# EAGLE design Sensors (EAGLE 8.1.1)
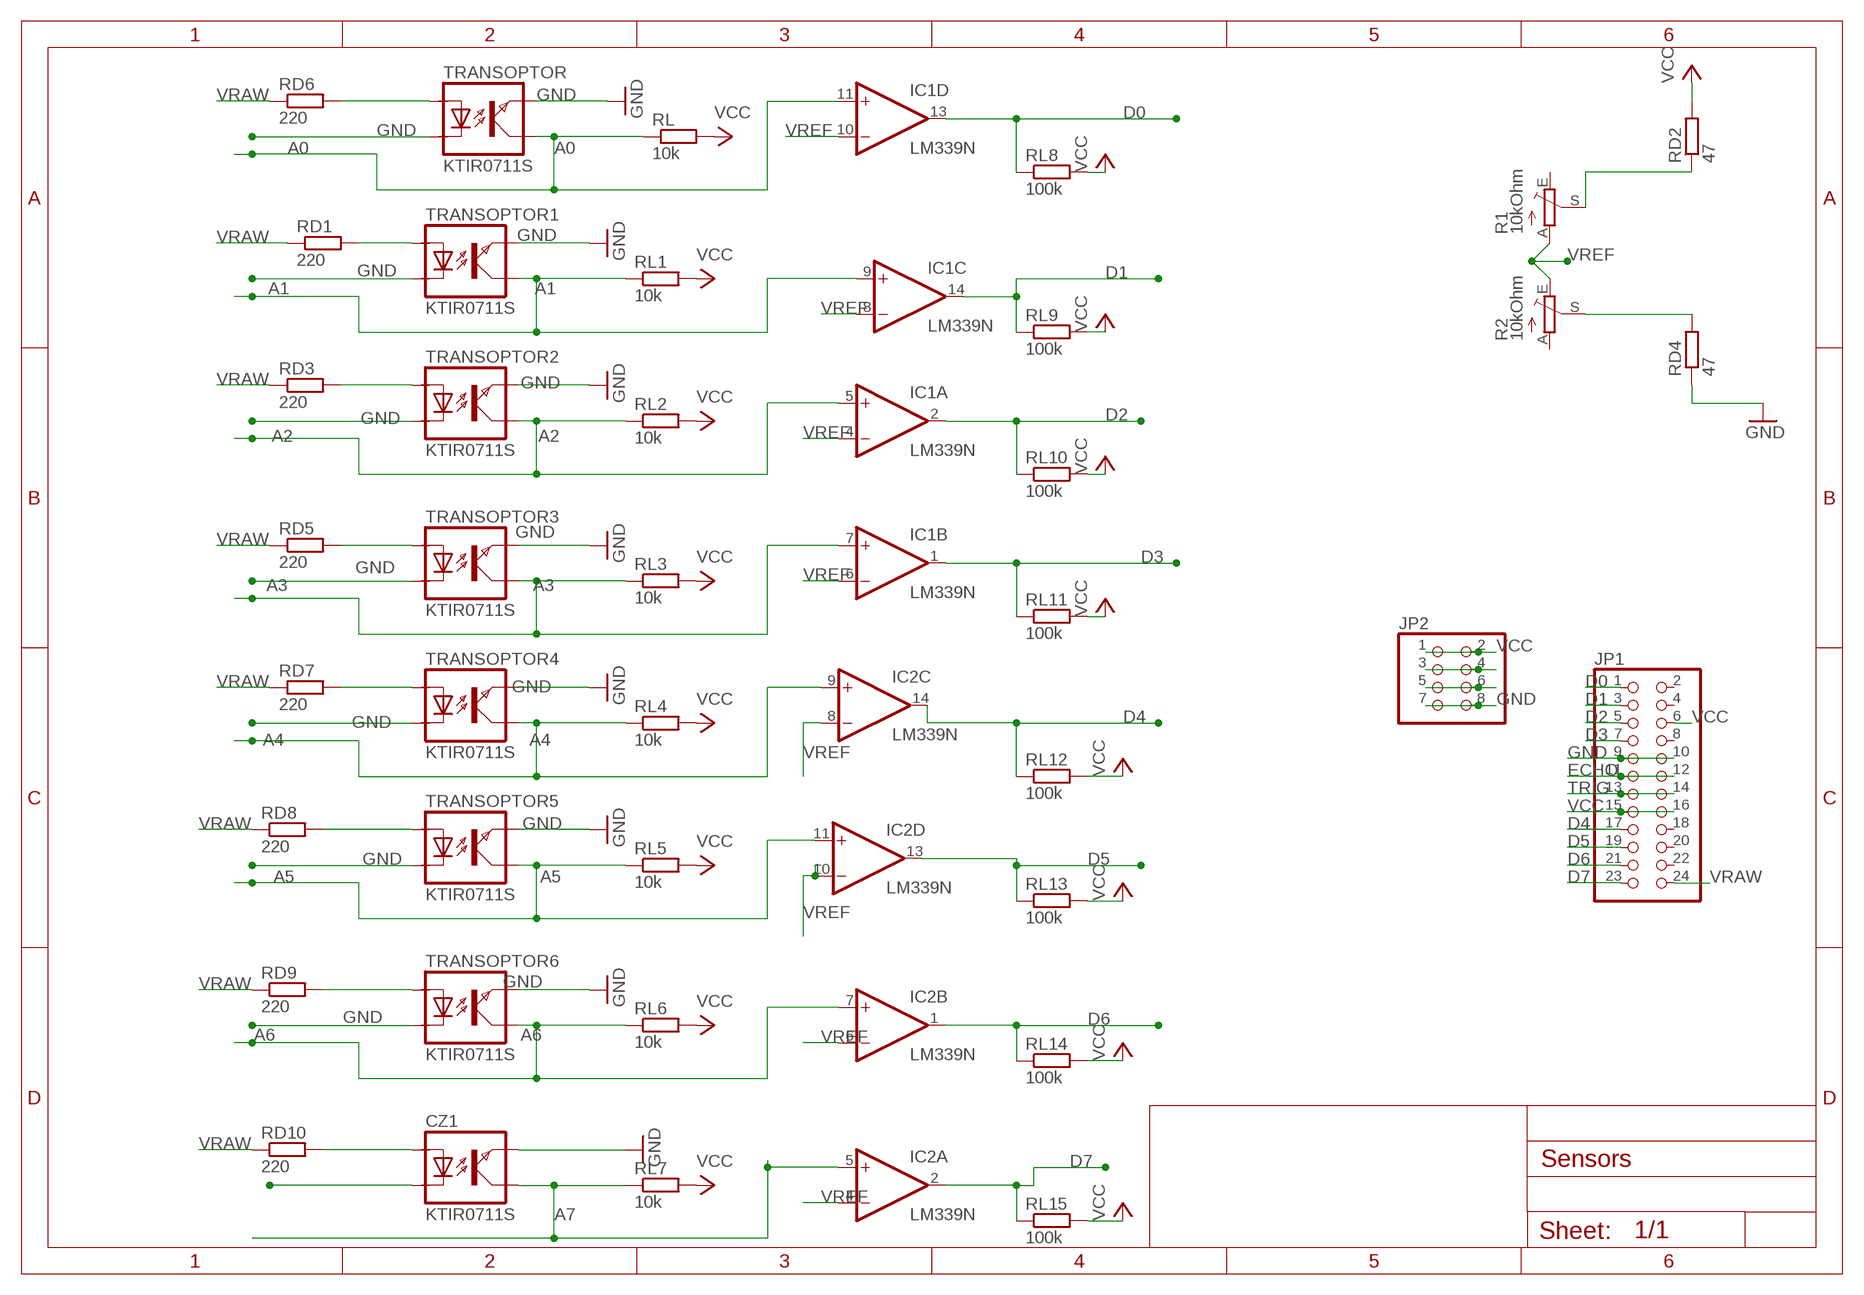
[diagram p0: schematic, sheet 1]

## Parts
CZ1  KTIR0711S  [TOP]
IC1  LM339N  [DIL14]
IC2  LM339N  [DIL14]
JP1  PINHD-2X12  [2X12]
JP2  PINHD-2X4  [2X04]
R1  10kOhm  TRIM_EU-CA6V  [CA6V]
R2  10kOhm  TRIM_EU-CA6V  [CA6V]
RD1  220  R-EU_0204/7  [0204/7]
RD2  47  R-EU_0204/7  [0204/7]
RD3  220  R-EU_0204/7  [0204/7]
RD4  47  R-EU_0204/7  [0204/7]
RD5  220  R-EU_0204/7  [0204/7]
RD6  220  R-EU_0204/7  [0204/7]
RD7  220  R-EU_0204/7  [0204/7]
RD8  220  R-EU_0204/7  [0204/7]
RD9  220  R-EU_0204/7  [0204/7]
RD10  220  R-EU_0204/7  [0204/7]
RL  10k  R-EU_0204/7  [0204/7]
RL1  10k  R-EU_0204/7  [0204/7]
RL2  10k  R-EU_0204/7  [0204/7]
RL3  10k  R-EU_0204/7  [0204/7]
RL4  10k  R-EU_0204/7  [0204/7]
RL5  10k  R-EU_0204/7  [0204/7]
RL6  10k  R-EU_0204/7  [0204/7]
RL7  10k  R-EU_0204/7  [0204/7]
RL8  100k  R-EU_0204/7  [0204/7]
RL9  100k  R-EU_0204/7  [0204/7]
RL10  100k  R-EU_0204/7  [0204/7]
RL11  100k  R-EU_0204/7  [0204/7]
RL12  100k  R-EU_0204/7  [0204/7]
RL13  100k  R-EU_0204/7  [0204/7]
RL14  100k  R-EU_0204/7  [0204/7]
RL15  100k  R-EU_0204/7  [0204/7]
TRANSOPTOR  KTIR0711S  [TOP]
TRANSOPTOR1  KTIR0711S  [TOP]
TRANSOPTOR2  KTIR0711S  [TOP]
TRANSOPTOR3  KTIR0711S  [TOP]
TRANSOPTOR4  KTIR0711S  [TOP]
TRANSOPTOR5  KTIR0711S  [TOP]
TRANSOPTOR6  KTIR0711S  [TOP]

## Nets
A0: IC1.11(D:+IN) RL.1 TRANSOPTOR.KOLEKTOR
A1: IC1.9(C:+IN) RL1.1 TRANSOPTOR1.KOLEKTOR
A2: IC1.5(A:+IN) RL2.1 TRANSOPTOR2.KOLEKTOR
A3: IC1.7(B:+IN) RL3.1 TRANSOPTOR3.KOLEKTOR
A4: IC2.9(C:+IN) RL4.1 TRANSOPTOR4.KOLEKTOR
A5: IC2.11(D:+IN) RL5.1 TRANSOPTOR5.KOLEKTOR
A6: IC2.7(B:+IN) RL6.1 TRANSOPTOR6.KOLEKTOR
A7: CZ1.KOLEKTOR IC2.5(A:+IN) RL7.1
D0: IC1.13(D:OUT) JP1.1 RL8.1
D1: IC1.14(C:OUT) JP1.3 RL9.1
D2: IC1.2(A:OUT) JP1.5 RL10.1
D3: IC1.1(B:OUT) JP1.7 RL11.1
D4: IC2.14(C:OUT) JP1.17 RL12.1
D5: IC2.13(D:OUT) JP1.19 RL13.1
D6: IC2.1(B:OUT) JP1.21 RL14.1
D7: IC2.2(A:OUT) JP1.23 RL15.1
DIODE0: RD6.2 TRANSOPTOR.ANODA
DIODE1: RD3.2 TRANSOPTOR2.ANODA
DIODE2: RD1.2 TRANSOPTOR1.ANODA
DIODE3: RD5.2 TRANSOPTOR3.ANODA
DIODE4: RD7.2 TRANSOPTOR4.ANODA
DIODE5: RD8.2 TRANSOPTOR5.ANODA
DIODE6: RD9.2 TRANSOPTOR6.ANODA
DIODE7: CZ1.ANODA RD10.2
ECHO: JP1.11 JP1.12 JP2.5 JP2.6
GND: CZ1.EMITER CZ1.KATODA JP1.9 JP1.10 JP2.7 JP2.8 RD4.1 TRANSOPTOR1.EMITER TRANSOPTOR1.KATODA TRANSOPTOR2.EMITER TRANSOPTOR2.KATODA TRANSOPTOR3.EMITER TRANSOPTOR3.KATODA TRANSOPTOR4.EMITER TRANSOPTOR4.KATODA TRANSOPTOR5.EMITER TRANSOPTOR5.KATODA TRANSOPTOR6.EMITER TRANSOPTOR6.KATODA TRANSOPTOR.EMITER TRANSOPTOR.KATODA
N$1: R2.S RD4.2
N$3: R1.S RD2.1
TRIG: JP1.13 JP1.14 JP2.3 JP2.4
VCC: JP1.6 JP1.15 JP1.16 JP2.1 JP2.2 RD2.2 RL1.2 RL2.2 RL3.2 RL4.2 RL5.2 RL6.2 RL7.2 RL8.2 RL9.2 RL10.2 RL11.2 RL12.2 RL13.2 RL14.2 RL15.2 RL.2
VRAW: JP1.24 RD1.1 RD3.1 RD5.1 RD6.1 RD7.1 RD8.1 RD9.1 RD10.1
VREF: IC1.4(A:-IN) IC1.6(B:-IN) IC1.8(C:-IN) IC1.10(D:-IN) IC2.4(A:-IN) IC2.6(B:-IN) IC2.8(C:-IN) IC2.10(D:-IN) R1.A R2.E
Unconnected: JP1.2 JP1.4 JP1.8 JP1.18 JP1.20 JP1.22 R1.E R2.A

## Power pins joined to a net without a drawn wire
GND: IC1.12(P:GND) IC2.12(P:GND)
VCC: IC1.3(P:V+) IC2.3(P:V+)

## Library data of the parts
CZ1 TRANSOPTOR TRANSOPTOR1-TRANSOPTOR6 = KTIR0711S:KTIR0711S
IC1 IC2 = linear:LM339: Low Power Low Offset Voltage Quad Comparators with open collector; LM139/LM239/LM339/LM2901/LM3302
JP1 = pinhead:PINHD-2X12: PIN HEADER
JP2 = pinhead:PINHD-2X4: PIN HEADER
R1 R2 = pot:TRIM_EU-: POTENTIOMETER
RD1-RD10 RL RL1-RL15 = resistor:R-EU_: RESISTOR, European symbol

## Board
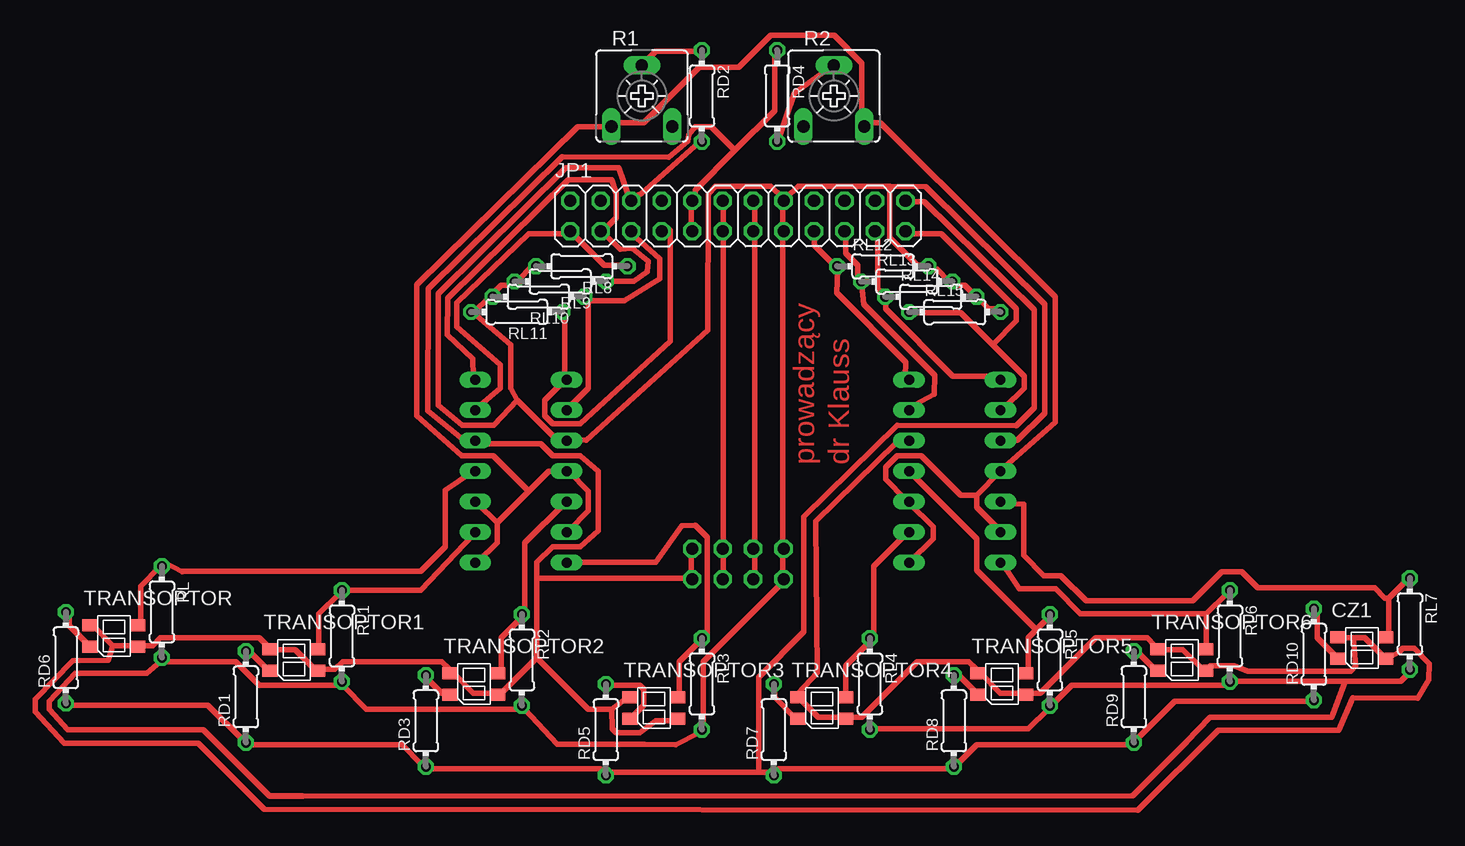
[diagram p1: board, top side]
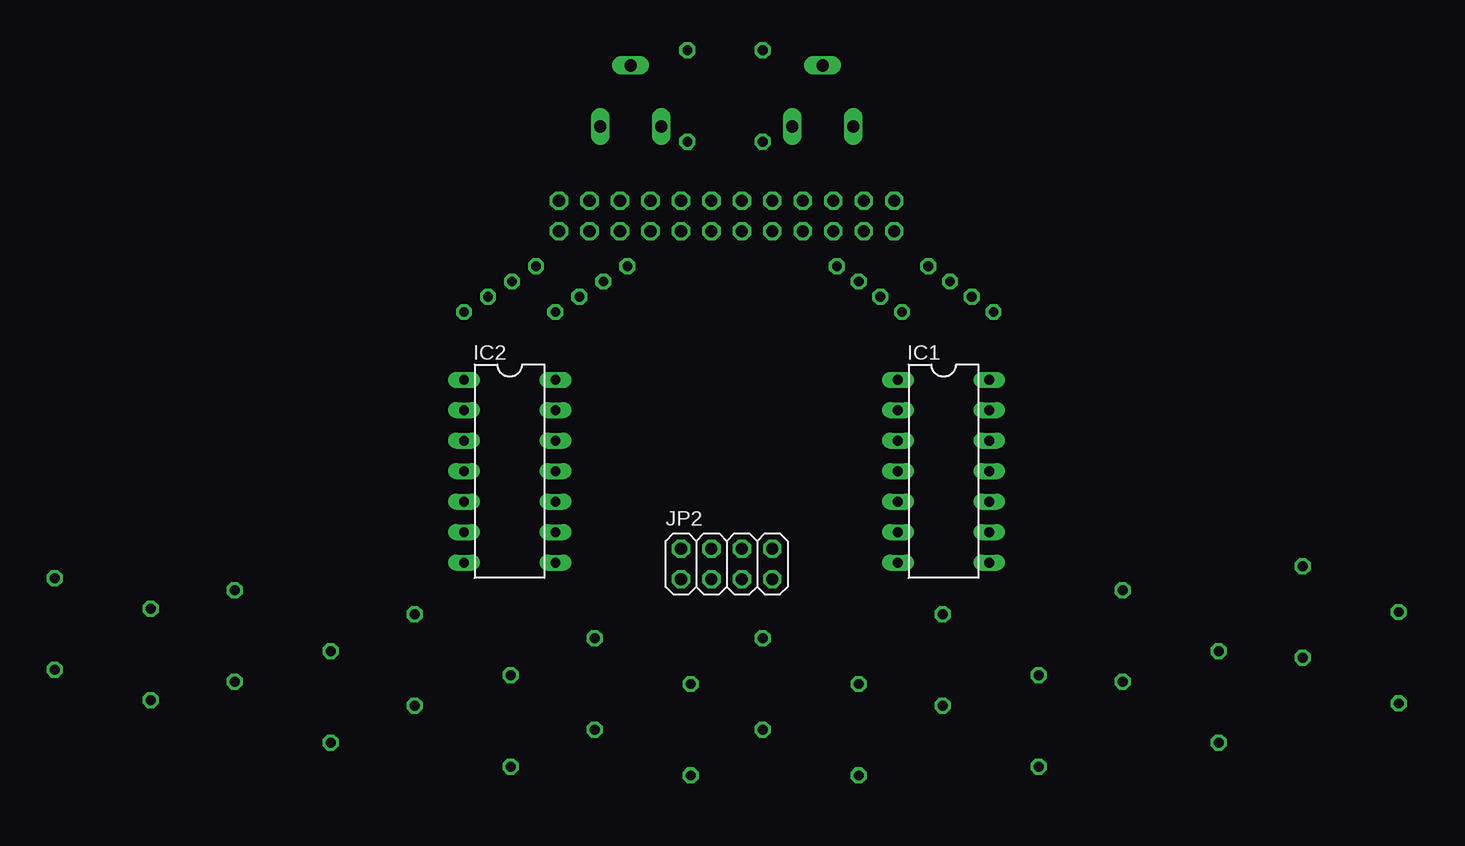
[diagram p2: board, bottom side, seen from below]

No outline drawn. Coordinates in mm, seen from the top.
Copper layers (1*16): Top 0.035mm / dielectric 1.5mm / Bottom 0.035mm
Design rules "default *": minimum track width 18mil, minimum drill 24mil, track to track 8mil, track to pad 8mil, pad to pad 8mil, via to via 8mil, smd to smd 8mil, copper to edge 40mil, drill to drill 8mil, minimum pad ring 10mil, minimum via ring 8mil, stop-mask expansion 4mil, vias tented up to drill 0mil, thermal gap 10mil

### Footprints (pad centres in the part's own frame; a part is rotated, then mirrored left to right if it is on the bottom)
TOP = smd 1.27 x 1: ANODA -1.985,-0.9; EMITER -1.985,0.9; KATODA 1.985,-0.9; KOLEKTOR 1.985,0.91
DIL14 = drill 0.813 long: 1 -7.62,-3.81; 2 -5.08,-3.81; 3 -2.54,-3.81; 4 0,-3.81; 5 2.54,-3.81; 6 5.08,-3.81; 7 7.62,-3.81; 8 7.62,3.81; 9 5.08,3.81; 10 2.54,3.81; 11 0,3.81; 12 -2.54,3.81; 13 -5.08,3.81; 14 -7.62,3.81
2X12 = drill 1.016 octagon: 1 -13.97,-1.27; 2 -13.97,1.27; 3 -11.43,-1.27; 4 -11.43,1.27; 5 -8.89,-1.27; 6 -8.89,1.27; 7 -6.35,-1.27; 8 -6.35,1.27; 9 -3.81,-1.27; 10 -3.81,1.27; 11 -1.27,-1.27; 12 -1.27,1.27; 13 1.27,-1.27; 14 1.27,1.27; 15 3.81,-1.27; 16 3.81,1.27; 17 6.35,-1.27; 18 6.35,1.27; 19 8.89,-1.27; 20 8.89,1.27; 21 11.43,-1.27; 22 11.43,1.27; 23 13.97,-1.27; 24 13.97,1.27
2X04 = drill 1.016 octagon: 1 -3.81,-1.27; 2 -3.81,1.27; 3 -1.27,-1.27; 4 -1.27,1.27; 5 1.27,-1.27; 6 1.27,1.27; 7 3.81,-1.27; 8 3.81,1.27
CA6V = drill 1.016 long: A -2.54,-2.54; E 2.54,-2.54; S 0,2.54
0204/7 = drill 0.813 octagon: 1 -3.81,0; 2 3.81,0

### Placement (x,y rotation side)
CZ1  113,15 0 top
IC1  42.92,29.73 270 bottom
IC2  79.08,29.73 270 bottom
JP1  61,51 0 top
JP2  61,22 0 bottom
R1  53,61 0 top
R2  69,61 0 top
RD1  20,10.92 90 top
RD2  58,61 270 top
RD3  35,8.92 90 top
RD4  64.27,61 270 top
RD5  50,8.19 90 top
RD6  5,14.19 90 top
RD7  64,8.19 90 top
RD8  79,8.92 90 top
RD9  94,10.92 90 top
RD10  109,14.46 90 top
RL  13,18 270 top
RL1  28,16 270 top
RL2  43,14 270 top
RL3  58,12 270 top
RL4  72,12 270 top
RL5  87,14 270 top
RL6  102,16 270 top
RL7  117,17 270 top
RL8  48,46.81 180 top
RL9  46.19,45.54 180 top
RL10  44.38,44.27 180 top
RL11  42.57,43 180 top
RL12  73.08,46.81 0 top
RL13  75.08,45.54 0 top
RL14  77.08,44.27 0 top
RL15  79.08,43 0 top
TRANSOPTOR  9,16 0 top
TRANSOPTOR1  24,14 0 top
TRANSOPTOR2  39,12 0 top
TRANSOPTOR3  54,10 0 top
TRANSOPTOR4  68,10 0 top
TRANSOPTOR5  83,12 0 top
TRANSOPTOR6  98,14 0 top

### Tracks (layer width: path | path; a pad name or v marks a point on that pad's centre or on a via)
A0
  Top 0.457: TRANSOPTOR.KOLEKTOR 11.23,17.17 11.23,20.14 12.88,21.79 RL.1 13.21,22.12 14.7,21.36 14.74,21.41 34.59,21.41 36.62,23.44 36.62,28.12 38.96,29.72 IC1.11
A1
  Top 0.457: TRANSOPTOR1.KOLEKTOR 26.09,15.19 26.09,17.83 27.74,19.48 RL1.1 28.07,19.81 34.56,19.8 38.96,24.43 IC1.9
A2
  Top 0.457: TRANSOPTOR2.KOLEKTOR 41.27,13.21 41.27,15.85 42.93,17.5 RL2.1 43.26,17.83 43.26,23.77 46.56,27.08 IC1.5
A3
  Top 0.457: TRANSOPTOR3.KOLEKTOR 56.13,11.23 56.13,13.87 57.78,15.52 RL3.1 58.12,15.85 58.45,16.18 58.45,24.24 57.45,25.23 56.33,25.19 54.15,22.12 46.89,22.12 IC1.7
A4
  Top 0.457: TRANSOPTOR4.KOLEKTOR 70,11.23 70,13.54 71.98,15.52 RL4.1 72.31,15.85 72.31,21.79 74.95,24.43 IC2.9
A5
  Top 0.457: 85.85,16.51 86.84,17.5 RL5.1 | 85.85,16.51 85.19,15.85 85.19,13.21 TRANSOPTOR5.KOLEKTOR | 85.85,16.51 80.9,21.46 80.9,24.11 75.29,29.72 IC2.11
A6
  Top 0.457: 100.05,17.83 100.05,15.19 TRANSOPTOR6.KOLEKTOR | 100.05,17.83 101.7,19.48 RL6.1 | 100.05,17.83 89.54,17.85 87.47,19.92 84.43,19.92 83.21,21.79 IC2.7
A7
  Top 0.457: 115.24,19.15 115.24,16.18 CZ1.KOLEKTOR | 115.24,19.15 116.89,20.8 RL7.1 | 115.24,19.15 114.92,19.15 114.07,20 104.33,20 102.97,21.36 101.34,21.36 98.9,18.92 90.01,18.92 87.9,21.03 86.5,21.03 84.8,22.73 84.8,26.98 83.21,27.08 IC2.5
D0
  Top 0.457: IC1.13 39.29,35 41.19,36.65 41.22,38.58 37.56,41.78 37.59,43.78 43.59,49.53 46.89,49.53 JP1.1 47.22,49.53 49.86,46.89 51.51,46.89 RL8.1
D1
  Top 0.457: IC1.14 38.96,37.64 38.91,39.11 36.8,41.11 36.84,44.15 46.87,54.04 50.5,54.04 50.85,52.83 50.85,50.85 49.86,49.86 JP1.3 49.86,49.53 51.18,48.21 52.2,48.29 53.51,47.23 53.47,46.37 52.33,45.57 50.19,45.57 RL9.1
D2
  Top 0.457: 48.54,43.92 48.54,36.65 46.89,35 IC1.2 | 48.54,43.92 48.21,44.25 RL10.1 48.54,43.92 | 48.54,43.92 51.51,43.92 54.47,45.77 54.47,47.42 52.17,49.53 JP1.5
D3
  Top 0.457: RL11.1 46.56,42.93 46.56,37.64 IC1.1 46.56,37.31 44.91,35.66 44.91,34.34 45.57,33.68 47.88,33.68 55.35,40.55 55.35,49.8 JP1.7
D4
  Top 0.457: IC2.14 74.95,37.64 74.98,38.79 69.23,44.61 69.34,46.56 RL12.1 69.01,46.89 67.36,48.54 67.36,49.53 JP1.17
D5
  Top 0.457: IC2.13 75.29,35 77.38,36.12 77.42,37.72 71.48,43.66 71.32,45.24 RL13.1 70.99,45.57 70.99,46.89 70,47.88 70,49.53 JP1.19
D6
  Top 0.457: IC2.1 82.88,37.64 78.92,37.64 73.3,43.26 73.3,44.25 RL14.1 72.97,44.58 72.64,44.91 72.64,49.53 JP1.21
D7
  Top 0.457: 82.22,40.28 84.86,37.64 84.86,36.65 83.21,35 IC2.2 | 82.22,40.28 79.58,42.93 75.29,42.93 RL15.1 | 82.22,40.28 84.2,42.27 84.2,43.26 77.93,49.53 75.29,49.53 JP1.23
DIODE0
  Top 0.457: TRANSOPTOR.ANODA 6.93,15.19 5.28,16.84 5.28,17.83 RD6.2
DIODE1
  Top 0.457: TRANSOPTOR2.ANODA 36.98,11.23 36.32,11.23 35,12.55 RD3.2
DIODE2
  Top 0.457: TRANSOPTOR1.ANODA 21.79,13.21 20.14,14.86 RD1.2
DIODE3
  Top 0.457: TRANSOPTOR3.ANODA 52.17,9.25 53.16,10.24 53.16,11.56 52.83,11.89 50.19,11.89 RD5.2
DIODE4
  Top 0.457: TRANSOPTOR4.ANODA 65.71,9.25 64.06,10.9 64.06,11.89 RD7.2
DIODE5
  Top 0.457: TRANSOPTOR5.ANODA 80.9,11.23 79.25,12.88 RD8.2
DIODE6
  Top 0.457: TRANSOPTOR6.ANODA 95.76,13.21 94.11,14.86 RD9.2
DIODE7
  Top 0.457: CZ1.ANODA 110.95,14.2 109.3,15.85 109.3,18.16 RD10.2
ECHO
  Top 0.457: JP2.5 59.77,20.8 59.77,23.11 JP2.6 59.77,23.44 59.77,49.53 JP1.11 59.77,49.86 59.77,52.17 JP1.12
GND
  Top 0.457: IC2.12 74.95,32.03 74.19,32.11 67.49,25.57 67.6,12.94 66.04,11.23 TRANSOPTOR4.EMITER 66.04,10.9 67.69,9.25 69.67,9.25 TRANSOPTOR4.KATODA 70,9.25 71.32,9.25 75.95,13.87 80.24,13.87 80.9,13.21 TRANSOPTOR5.EMITER 81.23,12.88 82.88,11.23 84.86,11.23 TRANSOPTOR5.KATODA 85.19,11.23 86.18,11.23 90.81,15.85 95.1,15.85 95.76,15.19 TRANSOPTOR6.EMITER 96.09,14.86 98.07,14.86 99.72,13.21 TRANSOPTOR6.KATODA 100.05,13.21 100.38,13.54 102.36,13.54 103.48,13.07 112.07,13.07 112.48,13.54 112.27,15.85 | 112.27,15.85 113.26,15.85 114.91,14.2 CZ1.KATODA 115.24,14.2 116.07,14.66 116.4,14.99 117.36,14.96 118.6,13.69 118.59,12.33 117.66,10.81 112.22,10.84 111.08,8.15 101.03,8.15 94.32,1.48 21.55,1.56 16.03,7.08 4.87,7.08 2.47,9.69 2.47,10.73 5.57,13.95 8.54,13.97 8.91,15.19 | 112.27,15.85 111.28,15.85 CZ1.EMITER | 60.76,56.46 57.45,53.16 57.45,52.5 JP1.10 57.12,52.17 57.12,49.86 JP1.9 | 60.76,56.46 64.06,59.77 64.06,64.72 RD4.1 | 8.91,15.19 10.9,15.19 TRANSOPTOR.KATODA 11.23,15.19 12.22,15.19 12.88,15.85 21.13,15.85 21.79,15.19 TRANSOPTOR1.EMITER 22.12,14.86 24.11,14.86 25.76,13.21 TRANSOPTOR1.KATODA 26.09,13.21 27.41,13.21 28.07,13.87 36.32,13.87 36.98,13.21 TRANSOPTOR2.EMITER 37.31,12.88 38.96,11.23 40.95,11.23 TRANSOPTOR2.KATODA 41.27,11.23 44.25,14.2 | 8.91,15.19 7.26,16.84 TRANSOPTOR.EMITER | 57.12,20.8 57.12,23.11 JP2.8 | 50.49,9.87 50.53,8.26 50.86,7.92 52.83,7.92 54.15,8.91 55.8,8.91 TRANSOPTOR3.KATODA | 50.49,9.87 51.84,10.9 TRANSOPTOR3.EMITER | 44.25,14.2 44.25,20.8 | 44.25,20.8 44.25,22.12 45.57,23.44 47.88,23.44 49.38,24.79 49.38,29.74 47.88,31.04 45.57,31.04 44.58,32.03 39.29,32.03 IC1.12 38.96,32.36 38.11,32.36 35.17,34.79 35.19,44.95 46.35,55.94 55.23,55.91 56.83,57.22 56.89,57.78 57.45,58.45 58.78,58.45 60.76,56.46
  Top 0.457: 50.49,9.87 48.54,9.91 44.25,14.2 | 44.25,20.8 57.12,20.8 | 57.12,20.8 JP2.7
N$1
  Top 0.457: RD4.2 64.39,57.45 65.7,61.23 68.68,63.4 R2.S
N$3
  Top 0.457: RD2.1 57.78,64.72 54.15,64.72 53.16,63.73 R1.S
TRIG
  Top 0.457: JP2.3 62.41,20.8 62.41,23.11 JP2.4 62.41,23.44 62.41,49.53 JP1.13 62.41,49.86 62.41,52.17 JP1.14
VCC
  Top 0.457: 111.6,12.22 116.23,12.22 116.89,12.88 RL7.2 | 111.6,12.22 102.03,12.22 RL6.2 101.7,11.89 88.82,11.89 87.17,10.24 RL5.2 86.84,9.91 85.19,8.26 72.31,8.26 RL4.2 | RD2.2 57.78,57.12 52.94,52.86 52.17,52.5 JP1.6 51.84,52.5 51.84,52.83 51.09,55.02 46.64,55.02 36.04,44.53 36.02,35.24 38.03,33.55 40.67,33.55 42.6,35.66 | RL8.2 43.92,46.89 42.6,45.57 RL9.2 42.27,45.24 41.27,45.24 40.62,44.58 RL10.2 40.28,44.25 38.96,42.93 | 42.6,35.66 42.07,36.62 42.07,40.26 38.96,42.93 | 42.6,35.66 45.9,32.36 46.56,32.36 IC1.3 46.89,32.36 48.36,32.3 58.49,41.48 58.51,52.77 59.11,53.49 63.73,53.49 64.72,52.5 JP1.16 | 38.96,42.93 RL11.2 | RL15.2 82.88,43.26 81.89,43.26 80.9,44.25 RL14.2 80.57,44.58 79.91,45.24 78.92,45.24 RL13.2 78.59,45.57 77.6,46.56 76.94,46.56 RL12.2 76.61,46.89 75.95,46.89 73.64,49.2 73.64,53.49 | 73.64,53.49 66.04,53.49 65.05,52.5 JP1.16 | 73.64,53.49 76.65,53.45 86.57,43.62 86.57,34.55 84.29,32.33 83.21,32.36 IC2.3 | JP1.16 64.72,52.17 64.72,49.86 JP1.15 64.72,49.53 64.72,23.44 JP2.2 64.72,23.11 64.72,20.8 JP2.1 64.72,20.47 58.12,13.87 58.12,8.26 RL3.2 57.78,7.92 55.8,6.95 53.2,6.97 45.93,6.97 43.26,9.91 RL2.2 42.93,9.91 30.05,9.91 28.07,11.89 RL1.2 27.74,11.89 21.13,11.89 19.15,13.87 13.21,13.87 RL.2 12.88,13.87 11.72,12.89 5.78,12.89 3.63,10.57 3.63,9.91 5.15,8.17 16.41,8.17 | 111.6,12.22 110.47,9.21 100.36,9.21 | 93.9,2.69 24.73,2.65
  Top 0.508: 16.41,8.17 16.45,8.17 21.95,2.67 24.71,2.67 24.73,2.65 | 100.36,9.21 98.37,7.16 93.9,2.69
VRAW
  Top 0.457: 62.74,4.62 63.73,4.62 RD7.1 64.06,4.62 64.39,4.95 78.92,4.95 RD8.1 79.25,5.28 80.9,6.93 93.78,6.93 RD9.1 94.11,7.26 97.41,10.57 108.97,10.57 RD10.1 | 62.74,4.62 50.19,4.62 RD5.1 49.86,4.62 49.53,4.95 35,4.95 RD3.1 34.67,5.28 33.02,6.93 20.14,6.93 RD1.1 19.81,7.26 16.84,10.24 5.28,10.24 RD6.1 | 62.74,4.62 62.74,12.55 66.47,16.36 66.47,25.93 74.3,33.56 84.2,33.52 85.68,35 85.68,43.17 76.55,52.17 75.29,52.17 JP1.24
VREF
  Top 0.457: 80.9,27.74 80.9,26.75 82.88,24.77 IC2.6 | 80.9,27.74 82.88,29.72 IC2.4 83.21,30.05 87.47,33.8 87.47,44.27 74.53,57.11 72.86,58.78 71.65,58.78 R2.E 71.32,58.78 71.32,63.73 69.01,66.04 63.73,66.04 61.09,63.4 57.78,63.4 53.16,58.78 50.52,58.78 R1.A 50.19,58.45 47.65,58.45 34.23,45.27 34.23,34.37 37.97,31.04 40.62,31.04 43.59,28.07 | IC2.8 75.29,22.12 77.27,24.11 77.27,25.09 75.29,27.08 IC2.10 74.95,27.41 73.3,29.06 73.3,30.05 74.3,31.04 76.28,31.04 79.58,27.74 80.9,27.74 | IC1.6 46.89,24.77 48.54,26.42 48.54,28.07 46.89,29.72 IC1.4 46.56,29.72 45.24,29.72 43.59,28.07 | 40.95,25.43 40.95,23.77 39.29,22.12 IC1.8 | 40.95,25.43 39.29,27.08 IC1.10 | 40.95,25.43 43.59,28.07

### Text on the board
Top: prowadzący | dr Klauss